# EAGLE design fan_pwm (EAGLE 9.6.2)
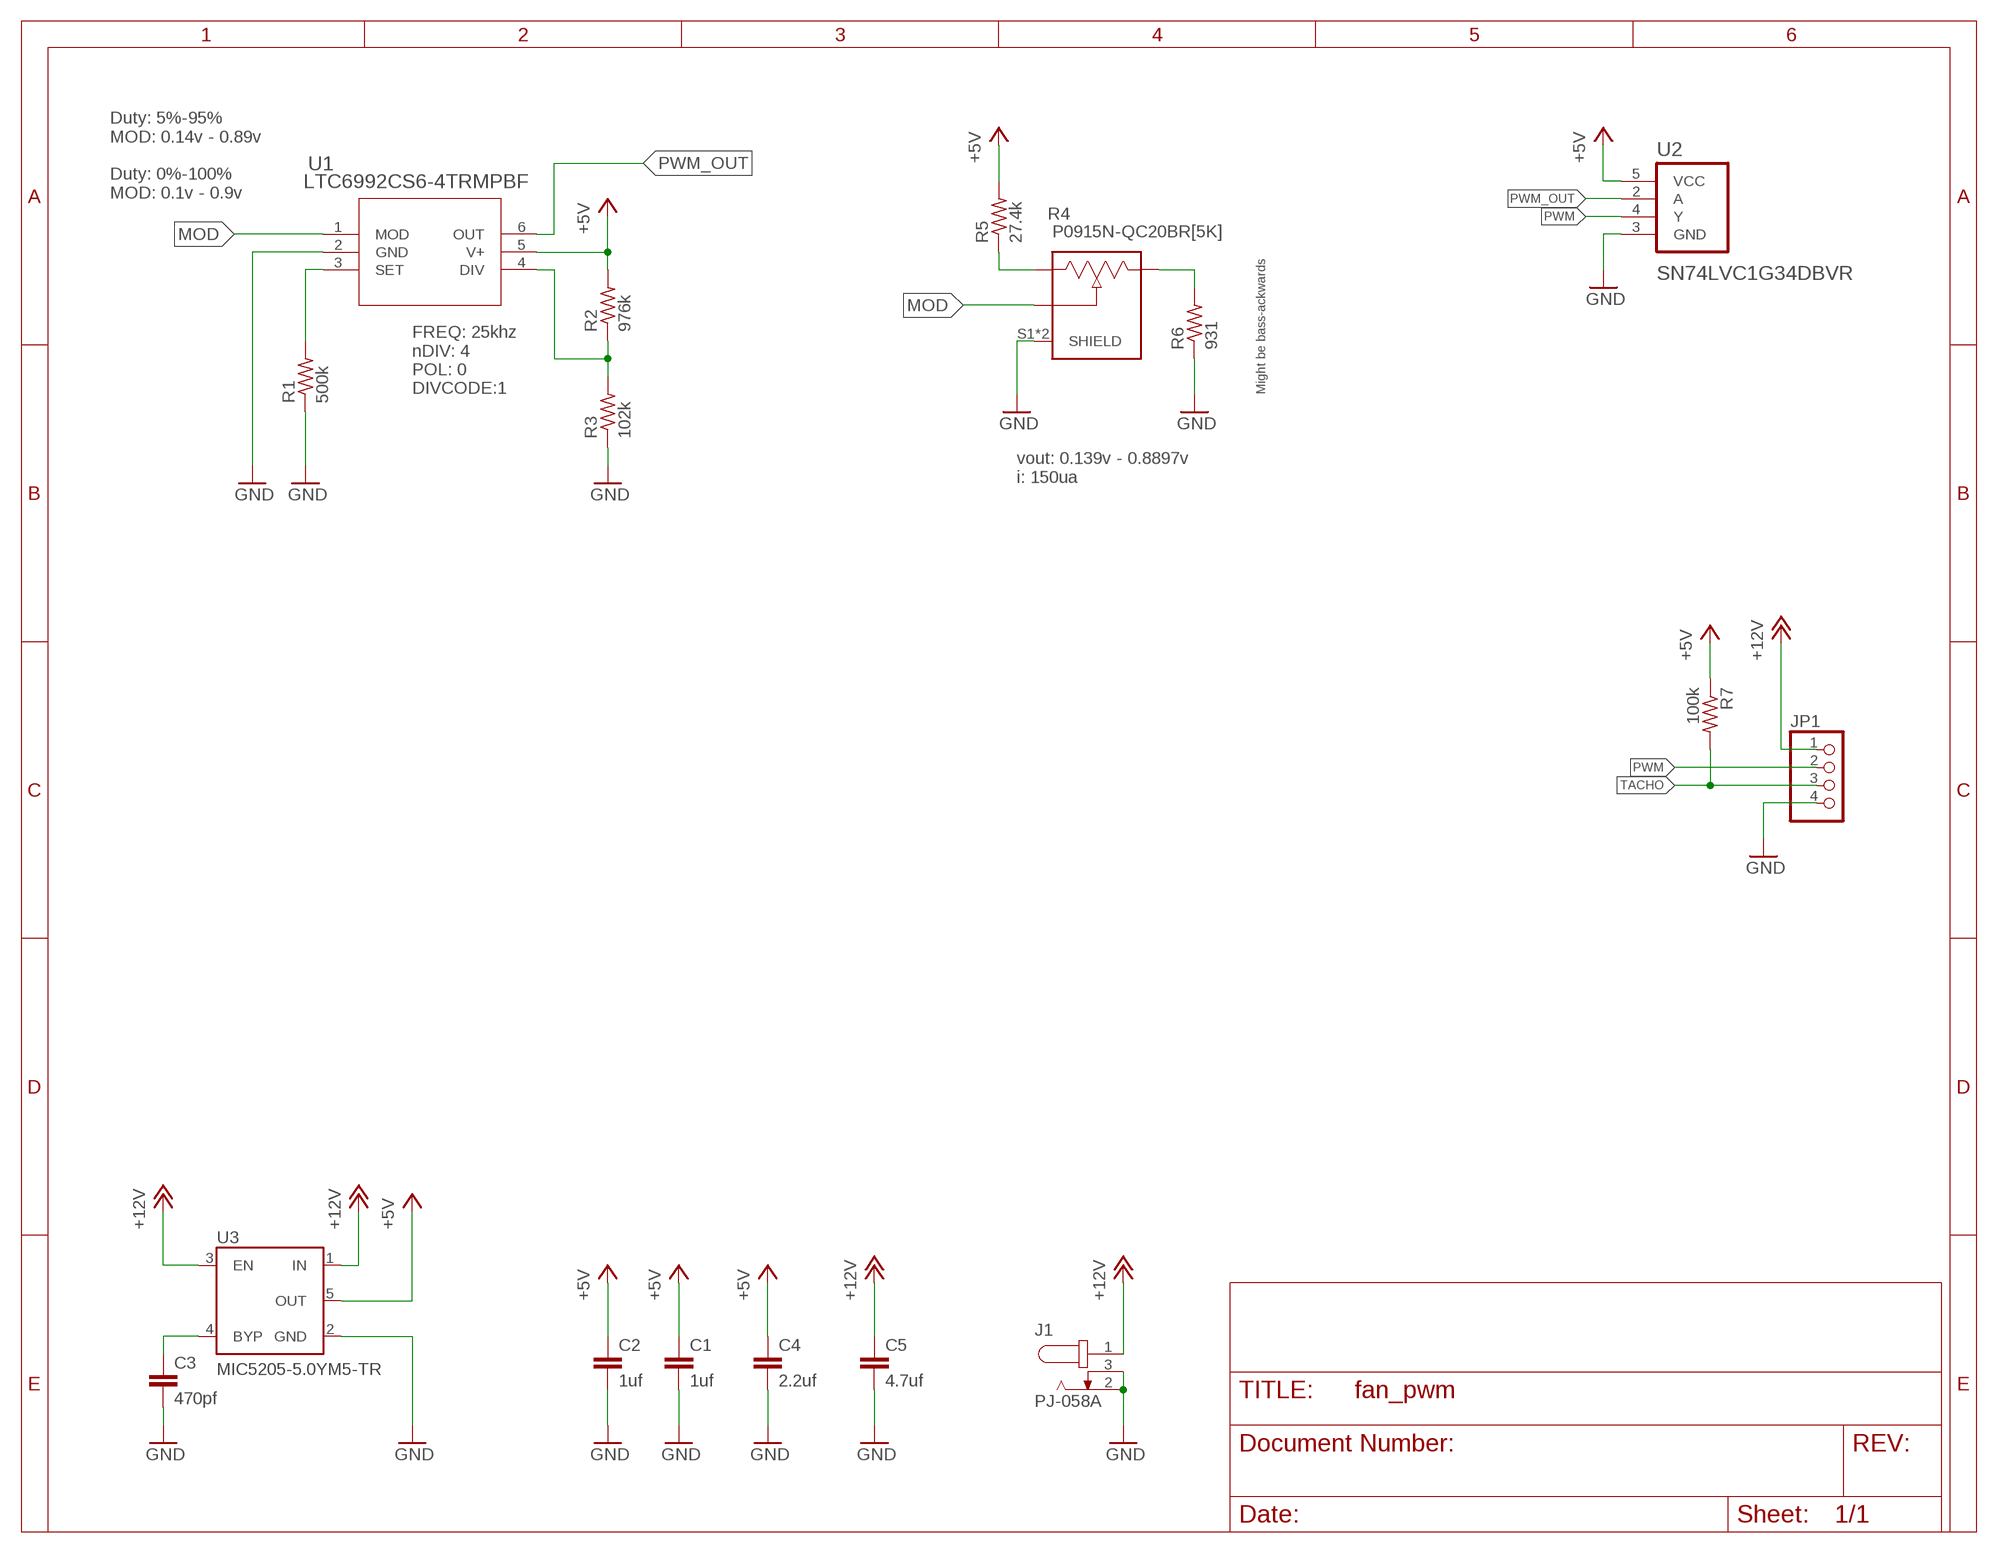
[diagram p0: schematic, sheet 1]

## Parts
C1  1uf  C-EUC0805  [C0805]
C2  1uf  C-EUC0805  [C0805]
C3  470pf  C-EUC0805  [C0805]
C4  2.2uf  C-EUC0805  [C0805]
C5  4.7uf  C-EUC0805  [C0805]
J1  PJ-058A  [CUI_PJ-058A]
JP1  PINHD-1X4  [1X04]
R1  500k  R-US_R0805  [R0805]
R2  976k  R-US_R0805  [R0805]
R3  102k  R-US_R0805  [R0805]
R4  P0915N-QC20BR[5K]  P0915N-QC20BR5K  [TRIM_P0915N-QC20BR5K]
R5  27.4k  R-US_R0805  [R0805]
R6  931  R-US_R0805  [R0805]
R7  100k  R-US_R0805  [R0805]
U1  LTC6992CS6-4TRMPBF  LTC6992CS6-4TRMPBFTSOT-23_S6_LIT-M  [TSOT-23_S6_LIT-M]
U2  SN74LVC1G34DBVR  [SOT95P280X145-5N]
U3  MIC5205-5.0YM5-TR  [SOT95P280X145-5N]

## Nets
+5V: C1.1 C2.1 C4.1 R2.2 R5.2 R7.1 U1.5(V+) U2.5(VCC) U3.5(OUT)
+12V: C5.1 J1.1 JP1.1 U3.1(IN) U3.3(EN)
GND: C1.2 C2.2 C3.2 C4.2 C5.2 J1.2 J1.3 JP1.4 R1.1 R3.1 R4.S1(SHIELD) R4.S2(SHIELD) R6.1 U1.2(GND) U2.3(GND) U3.2(GND)
MOD: R4.2 U1.1(MOD)
N$1: R1.2 U1.3(SET)
N$2: R4.1 R5.1
N$3: R2.1 R3.2 U1.4(DIV)
N$4: R4.3 R6.2
N$7: C3.1 U3.4(BYP)
PWM: JP1.2 U2.4(Y)
PWM_OUT: U1.6(OUT) U2.2(A)
TACHO: JP1.3 R7.2

## Notes on the sheet
- Duty: 5%-95%
  MOD: 0.14v - 0.89v
  
  Duty: 0%-100%
  MOD: 0.1v - 0.9v
- FREQ: 25khz
  nDIV: 4
  POL: 0
  DIVCODE:1
- Might be bass-ackwards
- vout: 0.139v - 0.8897v
  i: 150ua

## Library data of the parts
C1-C5 = rcl:C-EU: CAPACITOR, European symbol; SPICEPREFIX: C
J1 = PJ-058A:PJ-058A: 2.0 mm Center Pin, 2.5 A, Right Angle, Through Hole, Locking Type, Dc Power Jack Connector Check prices <https://pricing.snapeda.com/parts/PJ-058A/CUI%20Devices/view-part?ref=eda>; AVAILABILITY: In Stock; CUI_PURCHASE_URL: https://www.cuidevices.com/product/interconnect/connectors/dc-power-connectors/jacks/pj-058a?utm_source=snapeda.com&utm_medium=referral&utm_campaign=snapedaBOM; DESCRIPTION: 2.0 x 5.7 mm, 2.5 A, Horizontal, Through Hole, Locking Type, Dc Power Jack Connector; MF: CUI Devices; MP: PJ-058A; PACKAGE: None; PRICE: None; PURCHASE-URL: https://pricing.snapeda.com/search/part/PJ-058A/?ref=eda
JP1 = pinhead:PINHD-1X4: PIN HEADER
R1-R3 R5-R7 = rcl:R-US_: RESISTOR, American symbol; SPICEPREFIX: R
R4 = P0915N-QC20BR5K:P0915N-QC20BR5K: P09X Series 9 mm Side Adjustment 5 kOhm ±20 % Rotary Potentiometer; DESCRIPTION: 5k Ohm 1 Gang Linear Panel Mount Potentiometer None 1 Kierros Conductive Plastic 0.05W, 1/20W PC Pins, Board Locks; DIGI-KEY_PART_NUMBER: 987-1278-ND; MF: TT Electronics/BI; MP: P0915N-QC20BR5K; PACKAGE: None; PURCHASE-URL: https://pricing.snapeda.com/search/part/P0915N-QC20BR5K/?ref=eda
U1 = LTC6992:LTC6992CS6-4TRMPBF; COPYRIGHT: Copyright (C) 2021 Ultra Librarian. All rights reserved.; DIGI-KEY_PART_NUMBER_1: LTC6992CS6-4#TRMPBFCT-ND; DIGI-KEY_PART_NUMBER_2: LTC6992CS6-4#TRMPBFDKR-ND; DIGI-KEY_PART_NUMBER_3: LTC6992CS6-4#TRMPBFTR-ND; MANUFACTURER_PART_NUMBER: LTC6992CS6-4#TRMPBF; MFR_NAME: Analog Devices / Linear Technology
U2 = SN74LVC1G34DBVR:SN74LVC1G34DBVR; DESCRIPTION: Single Buffer Gate 5-SOT-23 -40 to 125; DIGI-KEY_PART_NUMBER: 296-17893-1-ND; MF: Texas Instruments; MP: SN74LVC1G34DBVR; PACKAGE: SOT-23-5 Texas Instruments; PURCHASE-URL: https://pricing.snapeda.com/search/part/SN74LVC1G34DBVR/?ref=eda
U3 = MIC5205-5.0YM5-TR:MIC5205-5.0YM5-TR: MIC5205 Series 3 V Fixed Output 150 mA SMT Low-Noise LDO Regulator - SOT-23-5; DESCRIPTION: Linear Voltage Regulator IC Positive Fixed 1 Output 150mA SOT-23-5; DIGI-KEY_PART_NUMBER: 576-1261-1-ND; MF: Microchip; MP: MIC5205-5.0YM5-TR; PACKAGE: SOT-23-5 Microchip; PURCHASE-URL: https://pricing.snapeda.com/search/part/MIC5205-5.0YM5-TR/?ref=eda

## Board
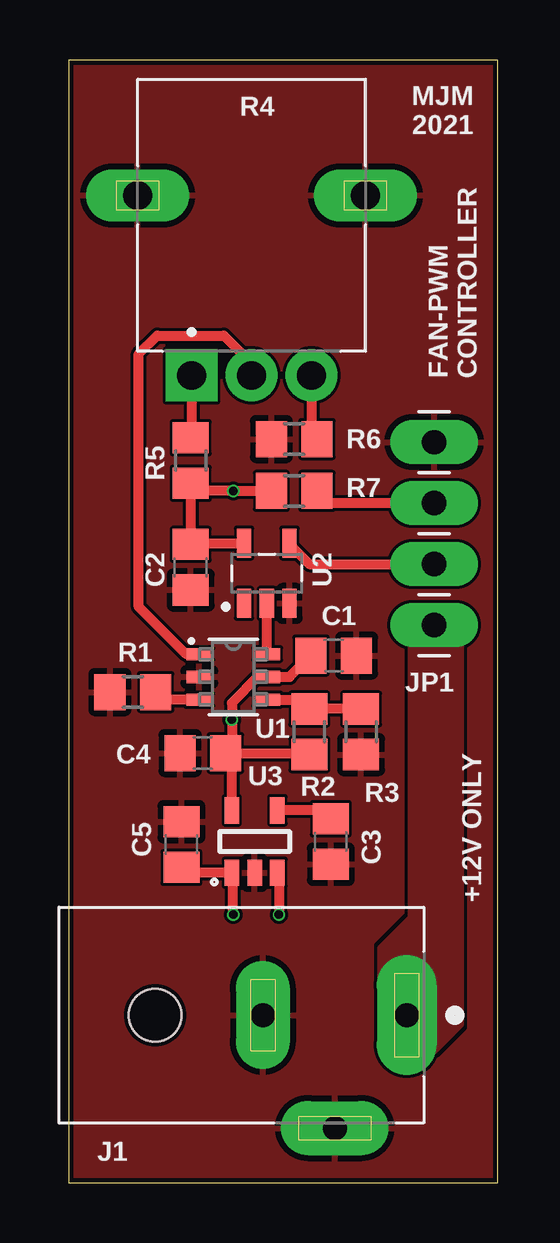
[diagram p1: board, top side]
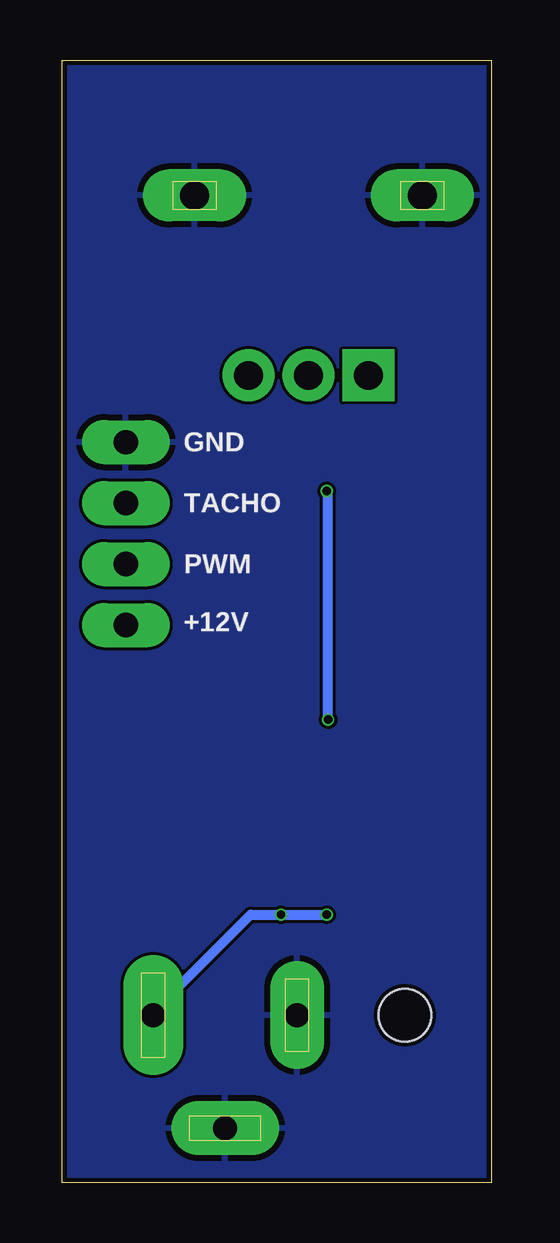
[diagram p2: board, bottom side, seen from below]

Size 17.89 x 46.79 mm. Coordinates in mm from the lower left corner, seen from the top.
Outline: 0,0 17.89,0 17.89,46.79 0,46.79 0,0
Copper layers (1*16): Top 0.035mm / dielectric 1.6mm / Bottom 0.035mm
Design rules "jlcpcb-2layers_tinted_vias": minimum track width 5mil, minimum drill 0.3mm, track to track 5mil, track to pad 5mil, pad to pad 5mil, via to via 5mil, smd to smd 5mil, copper to edge 0.2mm, drill to drill 6mil, minimum pad ring 10mil, minimum via ring 3mil, stop-mask expansion 4mil, vias tented up to drill 20mil, thermal gap 10mil

### Footprints (pad centres in the part's own frame; a part is rotated, then mirrored left to right if it is on the bottom)
C0805 = smd 1.3 x 1.5: 1 -0.95,0; 2 0.95,0
CUI_PJ-058A = drill 1 pad 2.5 long: 1 0,0 | drill 1 pad 2.25 long: 2 6,0; 3 3,4.7 | hole 2.2: 10.5,0
1X04 = drill 1.016 long: 1 -3.81,0; 2 -1.27,0; 3 1.27,0; 4 3.81,0
R0805 = smd 1.3 x 1.5: 1 -0.95,0; 2 0.95,0
TRIM_P0915N-QC20BR5K = drill 1.2 square: 1 -2.5,-5.725 | drill 1.2: 2 0,-5.725; 3 2.5,-5.725 | drill 1.2 long: S1 -4.75,1.775; S2 4.75,1.775
TSOT-23_S6_LIT-M = smd 1.079 x 0.508: 1 -1.416,0.95; 2 -1.416,0; 3 -1.416,-0.95; 4 1.416,-0.95; 5 1.416,0; 6 1.416,0.95
SOT95P280X145-5N = smd 1.21 x 0.59: 1 -1.255,0.95; 2 -1.255,0; 3 -1.255,-0.95; 4 1.255,-0.95; 5 1.255,0.95
SOT95P280X145-5N' = smd 1.1 x 0.6: 1 -1.3,0.95; 2 -1.3,0; 3 -1.3,-0.95; 4 1.3,-0.95; 5 1.3,0.95

### Placement (x,y rotation side)
C1  11.05,21.97 0 top
C2  5.08,25.65 270 top
C3  10.92,14.22 270 top
C4  5.59,17.91 180 top
C5  4.7,14.1 90 top
J1  14.1,6.98 180 top
JP1  15.24,27.05 90 top
R1  2.67,20.45 0 top
R2  10.03,18.8 270 top
R3  12.19,18.8 90 top
R4  7.62,39.37 0 top
R5  5.08,30.1 270 top
R6  9.4,30.99 0 top
R7  9.4,28.83 0 top
U1  6.86,21.08 0 top
U2  8.26,25.4 90 top
U3  MIC5205-5.0YM5-TR  [SOT95P280X145-5N']  7.75,14.22 90 top

### Tracks (layer width: path | path; a pad name or v marks a point on that pad's centre or on a via)
+5V  (via drill 0.35)
  Top 0.406: C1.1 9.21,21.08 U1.5 7.87,21.08 6.8,20 v6.8,19.3 6.8,18.17 C4.1 | U2.5 5.13,26.66 C2.1 5.08,28.96 | R5.2 5.08,28.96 | U3.5 6.8,17.65 C4.1 | C4.1 9.97,17.91 R2.2 | 5.08,28.96 5.21,28.83 v6.86,28.83 R7.1
  Bottom 0.406: v6.8,19.3 6.8,28.83 v6.86,28.83
+12V  (via drill 0.35)
  Top 0.406: C5.1 4.92,12.92 U3.1 6.86,12.86 v6.86,11.18 | U3.3 8.76,12.86 v8.76,11.18
  Bottom 0.406: v6.86,11.18 v8.76,11.18 10.03,11.18 14.1,7.11 J1.1
  pour Top (no thermals): 12.95,9.78 12.95,6.48 13.97,5.46 15.24,5.46 16.38,6.6 16.38,23.88 14.22,23.88 14.22,11.05
GND
  pour Top (rank 4): -0.51,48.39 20.32,48.39 20.32,-1.91 -0.51,-1.91
  pour Bottom: -0.51,48.39 20.32,48.39 20.32,-1.91 -0.51,-1.91
MOD
  Top 0.406: U1.1 4.89,22.03 2.92,24 2.92,34.54 3.68,35.31 6.47,35.31 7.62,34.15 R4.2
N$1
  Top 0.406: U1.3 3.93,20.13 R1.2
N$2
  Top 0.406: R4.1 5.12,31.09 R5.1
N$3
  Top 0.406: U1.4 9.65,20.13 R2.1 R3.2
N$4
  Top 0.406: R4.3 10.12,31.07 R6.2
N$7
  Top 0.406: C3.1 10.57,15.52 U3.4
PWM
  Top 0.406: JP1.2 10.03,25.78 9.21,26.61 U2.4
PWM_OUT
  Top 0.406: U1.6 8.26,22.05 U2.2
TACHO
  Top 0.406: R7.2 10.86,28.32 JP1.3

### Text on the board
tPlace: MJM / 2021 | FAN-PWM / CONTROLLER | +12V ONLY
bPlace: GND | TACHO | PWM | +12V